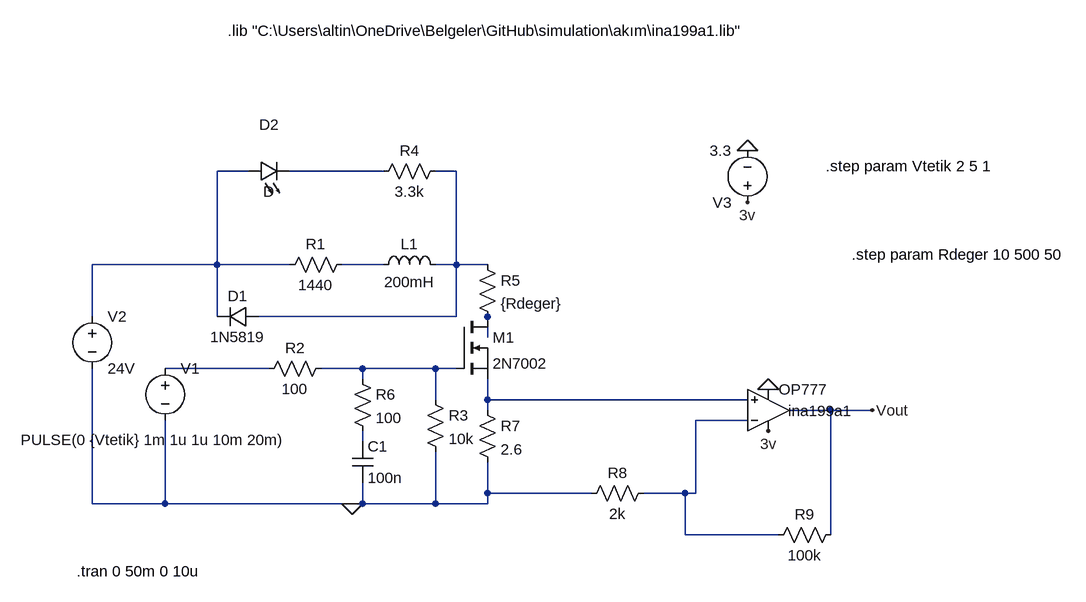
[diagram p0: schematic Bobibn ile seri R-L devresi_valueli_v1_.asc]
Bobibn ile seri R-L devresi_valueli_v1_.asc, the LTspice schematic file:
Version 4.1
SHEET 1 1280 712
WIRE -16 -16 -64 -16
WIRE 192 -16 48 -16
WIRE 304 -16 272 -16
WIRE -64 128 -64 -16
WIRE -64 128 -256 128
WIRE 48 128 -64 128
WIRE 192 128 128 128
WIRE 304 128 304 -16
WIRE 304 128 272 128
WIRE 352 128 304 128
WIRE -256 208 -256 128
WIRE -64 208 -64 128
WIRE 304 208 304 128
WIRE 304 208 0 208
WIRE 352 240 352 208
WIRE 16 288 -144 288
WIRE 160 288 96 288
WIRE 272 288 160 288
WIRE 304 288 272 288
WIRE 160 304 160 288
WIRE 272 336 272 288
WIRE 352 336 352 304
WIRE 752 336 352 336
WIRE 352 352 352 336
WIRE 880 352 816 352
WIRE 944 352 880 352
WIRE 752 368 672 368
WIRE 160 400 160 384
WIRE 352 480 352 432
WIRE 512 480 352 480
WIRE 656 480 592 480
WIRE 672 480 672 368
WIRE 672 480 656 480
WIRE -256 496 -256 288
WIRE -144 496 -144 368
WIRE -144 496 -256 496
WIRE 144 496 -144 496
WIRE 160 496 160 464
WIRE 160 496 144 496
WIRE 272 496 272 416
WIRE 272 496 160 496
WIRE 352 496 352 480
WIRE 352 496 272 496
WIRE 656 544 656 480
WIRE 800 544 656 544
WIRE 880 544 880 352
FLAG 144 496 0
FLAG 752 -48 0
FLAG 784 384 3v
FLAG 752 32 3v
FLAG 784 320 0
FLAG 944 352 Vout
SYMBOL res 144 112 R90
WINDOW 0 0 56 VBottom 2
WINDOW 3 32 56 VTop 2
SYMATTR InstName R1
SYMATTR Value 1440
SYMBOL ind 176 144 R270
WINDOW 0 32 56 VTop 2
WINDOW 3 5 56 VBottom 2
SYMATTR InstName L1
SYMATTR Value 200mH
SYMATTR SpiceLine Rser=1m
SYMBOL res 112 272 R90
WINDOW 0 0 56 VBottom 2
WINDOW 3 32 56 VTop 2
SYMATTR InstName R2
SYMATTR Value 100
SYMBOL voltage -144 272 R0
WINDOW 3 -222 126 Left 2
WINDOW 123 0 0 Left 0
WINDOW 39 0 0 Left 0
SYMATTR Value PULSE(0 {Vtetik} 1m 1u 1u 10m 20m)
SYMATTR InstName V1
SYMBOL voltage -256 192 R0
WINDOW 123 0 0 Left 0
WINDOW 39 0 0 Left 0
SYMATTR InstName V2
SYMATTR Value 24V
SYMBOL diode 0 192 R90
WINDOW 0 0 32 VBottom 2
WINDOW 3 32 32 VTop 2
SYMATTR InstName D1
SYMATTR Value 1N5819
SYMBOL nmos 304 208 R0
SYMATTR InstName M1
SYMATTR Value 2N7002
SYMBOL res 256 320 R0
SYMATTR InstName R3
SYMATTR Value 10k
SYMBOL LED -16 0 R270
WINDOW 0 72 32 VTop 2
WINDOW 3 0 32 VBottom 2
SYMATTR InstName D2
SYMBOL res 176 0 R270
WINDOW 0 32 56 VTop 2
WINDOW 3 0 56 VBottom 2
SYMATTR InstName R4
SYMATTR Value 3.3k
SYMBOL res 336 112 R0
SYMATTR InstName R5
SYMATTR Value {Rdeger}
SYMBOL res 144 288 R0
SYMATTR InstName R6
SYMATTR Value 100
SYMBOL cap 144 400 R0
SYMATTR InstName C1
SYMATTR Value 100n
SYMBOL res 336 336 R0
SYMATTR InstName R7
SYMATTR Value 2.6
SYMBOL voltage 752 48 R180
WINDOW 123 0 0 Left 0
WINDOW 39 0 0 Left 0
SYMATTR InstName V3
SYMATTR Value 3.3
SYMBOL res 608 464 R90
WINDOW 0 0 56 VBottom 2
WINDOW 3 32 56 VTop 2
SYMATTR InstName R8
SYMATTR Value 2k
SYMBOL res 896 528 R90
WINDOW 0 0 56 VBottom 2
WINDOW 3 32 56 VTop 2
SYMATTR InstName R9
SYMATTR Value 100k
SYMBOL OpAmps\\OP777 784 416 M180
WINDOW 0 31 63 Left 2
SYMATTR InstName ina199a1
TEXT -280 600 Left 2 !.tran 0 50m 0 10u
TEXT 912 112 Left 2 !.step param Rdeger 10 500 50
TEXT 872 -24 Left 2 !.step param Vtetik 2 5 1
TEXT -48 -232 Left 2 !.lib "C:\\Users\\altin\\OneDrive\\Belgeler\\GitHub\\simulation\\akım\\ina199a1.lib"

The netlist it stands for:
* Bobibn ile seri R-L devresi_valueli_v1_.asc
R1 N004 N001 1440
L1 N004 N003 200mH Rser=1m
R2 N007 N006 100
V1 N006 0 PULSE(0 {Vtetik} 1m 1u 1u 10m 20m)
V2 N001 0 24V
D1 N003 N001 1N5819
M1 N005 N007 N008 N008 2N7002
R3 N007 0 10k
D2 N001 N002 D
R4 N002 N003 3.3k
R5 N003 N005 {Rdeger}
R6 N007 N010 100
C1 N010 0 100n
R7 N008 0 2.6
V3 3v 0 3.3
R8 N009 0 2k
R9 Vout N009 100k
X§ina199a1 N008 N009 3v 0 Vout OP777  ; pins In+ In- V+ V- OUT
.model D D
.lib standard.dio
.model NMOS NMOS
.model PMOS PMOS
.lib standard.mos
.tran 0 50m 0 10u
.step param Rdeger 10 500 50
.step param Vtetik 2 5 1
.lib "C:\Users\altin\OneDrive\Belgeler\GitHub\simulation\akım\ina199a1.lib"
.lib ADI.lib
.backanno
.end